# Altium schematic sheet Slave_Supply.SchDoc
size A4
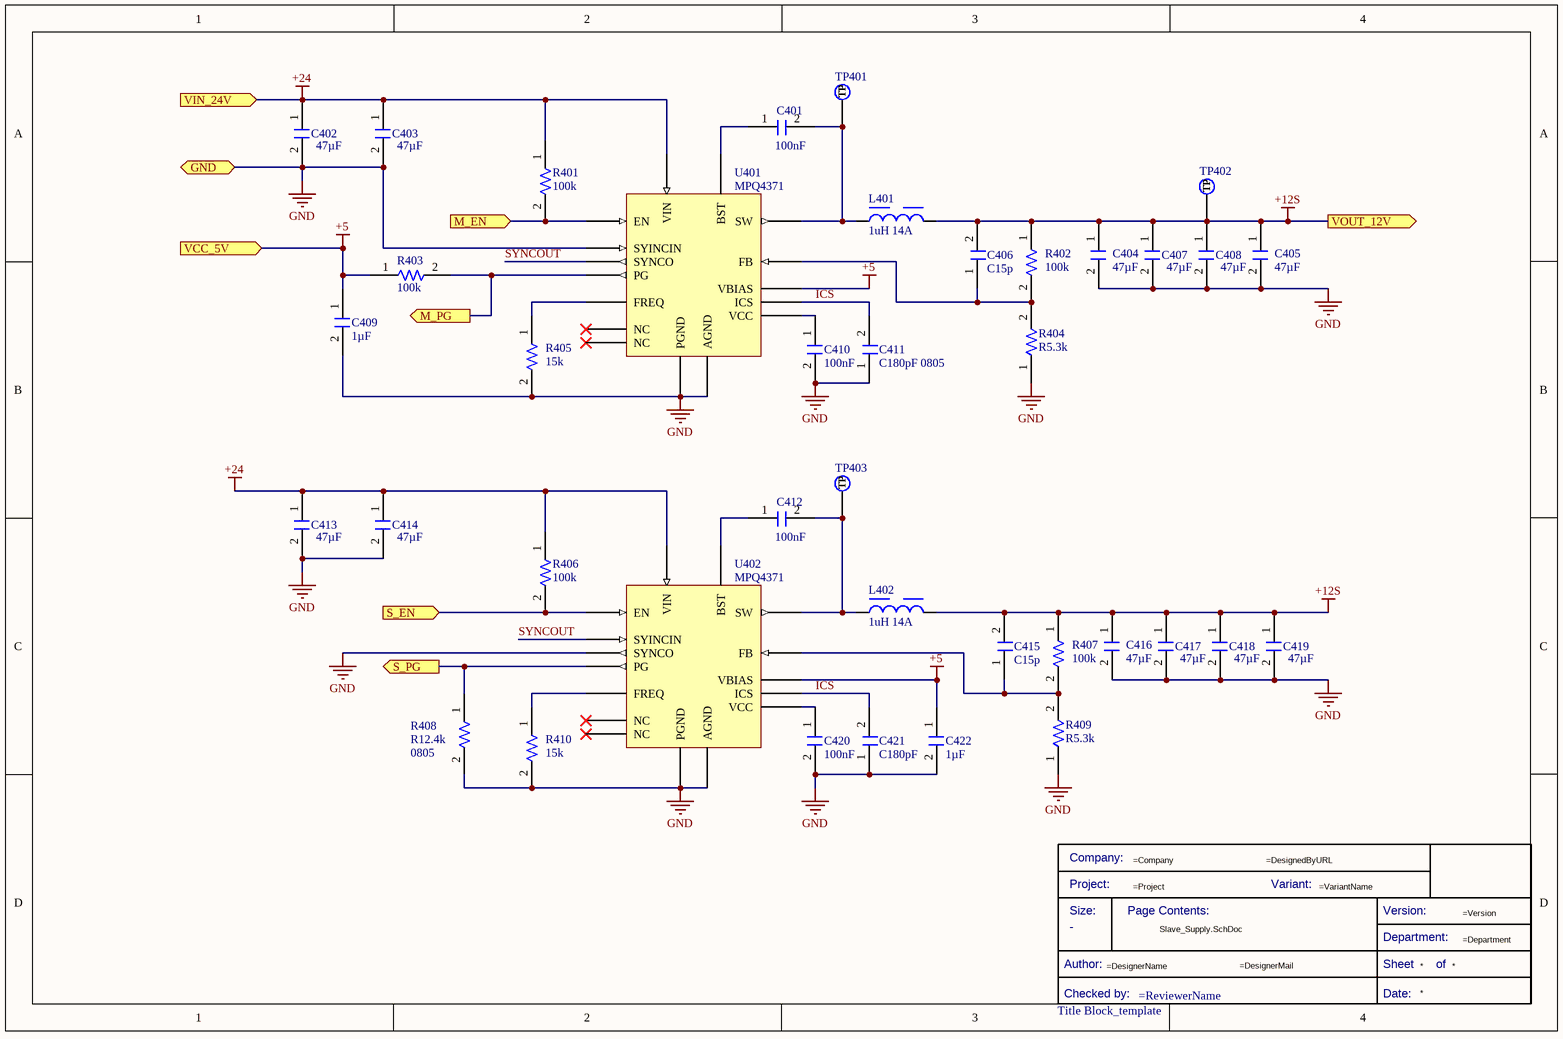
[diagram p0: Slave_Supply.SchDoc]

## Parts
*?  Title Block_template  (graphical)
C401  value 100nF  [C0805FNPC-R]  (hidden comment: C100n-50V-0805FNPC-X7R)
C402  value 47µF  [FP-GRM32E-0_3-0_2-IPC_C]  (hidden comment: GRM32EC81A476KE19L)
C403  value 47µF  [FP-GRM32E-0_3-0_2-IPC_C]  (hidden comment: GRM32EC81A476KE19L)
C404  value 47µF  [FP-GRM32E-0_3-0_2-IPC_C]  (hidden comment: GRM32EC81A476KE19L)
C405  value 47µF  [FP-GRM32E-0_3-0_2-IPC_C]  (hidden comment: GRM32EC81A476KE19L)
C406  C15p  [C0805FNPC-R]
C407  value 47µF  [FP-GRM32E-0_3-0_2-IPC_C]  (hidden comment: GRM32EC81A476KE19L)
C408  value 47µF  [FP-GRM32E-0_3-0_2-IPC_C]  (hidden comment: GRM32EC81A476KE19L)
C409  value 1µF  [C0805FNPC-R]  (hidden comment: C1u-50V-0805FNPC-X7R)
C410  value 100nF  [C0805FNPC-R]  (hidden comment: C100n-50V-0805FNPC-X7R)
C411  C180pF 0805  [C0805FNPC-W]
C412  value 100nF  [C0805FNPC-R]  (hidden comment: C100n-50V-0805FNPC-X7R)
C413  value 47µF  [FP-GRM32E-0_3-0_2-IPC_C]  (hidden comment: GRM32EC81A476KE19L)
C414  value 47µF  [FP-GRM32E-0_3-0_2-IPC_C]  (hidden comment: GRM32EC81A476KE19L)
C415  C15p  [C0805FNPC-R]
C416  value 47µF  [FP-GRM32E-0_3-0_2-IPC_C]  (hidden comment: GRM32EC81A476KE19L)
C417  value 47µF  [FP-GRM32E-0_3-0_2-IPC_C]  (hidden comment: GRM32EC81A476KE19L)
C418  value 47µF  [FP-GRM32E-0_3-0_2-IPC_C]  (hidden comment: GRM32EC81A476KE19L)
C419  value 47µF  [FP-GRM32E-0_3-0_2-IPC_C]  (hidden comment: GRM32EC81A476KE19L)
C420  value 100nF  [C0805FNPC-R]  (hidden comment: C100n-50V-0805FNPC-X7R)
C421  C180pF  [C0805FNPC-W]
C422  value 1µF  [C0805FNPC-R]  (hidden comment: C1u-50V-0805FNPC-X7R)
L401  1uH 14A  [WE-HCI_1030]
L402  1uH 14A  [WE-HCI_1030]
R401  value 100k  [RESC2013X70X40NL20T20]  (hidden comment: ERJ-6GEYJ104V)
R402  value 100k  [FP-CR0805-IPC_A]  (hidden comment: R60.4K-0805)
R403  value 100k  [RESC2013X70X40NL20T20]  (hidden comment: ERJ-6GEYJ104V)
R404  R5.3k  [0805]
R405  value 15k  [RESC2013X50X30ML20T20]  (hidden comment: R15K-0805)
R406  value 100k  [RESC2013X70X40NL20T20]  (hidden comment: ERJ-6GEYJ104V)
R407  value 100k  [FP-CR0805-IPC_A]  (hidden comment: R60.4K-0805)
R408  0805  value R12.4k  [0805]
R409  R5.3k  [0805]
R410  value 15k  [RESC2013X50X30ML20T20]  (hidden comment: R15K-0805)
TP401  TestPoint  [TestPoint]  (value not drawn)  (no BOM)
TP402  TestPoint  [TestPoint]  (value not drawn)  (no BOM)
TP403  TestPoint  [TestPoint]  (value not drawn)  (no BOM)
U401  MPQ4371  [MPQ4371-AEQ1]
U402  MPQ4371  [MPQ4371-AEQ1]

## Ports
GND (bidir), M_EN (in), M_PG (out), S_EN (in), S_PG (out), VCC_5V (in), VIN_24V (in), VOUT_12V (out)

## Nets
+5: C409.1 C422.1 R403.1 U401.11(VBIAS) U402.11(VBIAS) ; port VCC_5V
+12S: C404.1 C405.1 C406.2 C407.1 C408.1 C415.2 C416.1 C417.1 C418.1 C419.1 L401.2 L402.2 R402.1 R407.1 TP402.1(TP) ; port VOUT_12V
+24: C402.1 C403.1 C413.1 C414.1 R401.1 R406.1 U401.15(VIN) U402.15(VIN) ; port VIN_24V
GND: C402.2 C403.2 C404.2 C405.2 C407.2 C408.2 C409.2 C410.2 C411.1 C413.2 C414.2 C416.2 C417.2 C418.2 C419.2 C420.2 C421.1 C422.2 R404.1 R405.2 R408.2 R409.1 R410.2 U401.2(SYINCIN) U401.7(PGND) U401.8(AGND) U402.3(SYNCO) U402.7(PGND) U402.8(AGND) ; port GND
ICS: C411.2 C421.2 U401.10(ICS) U402.10(ICS)
M_EN: R401.2 U401.1(EN) ; port M_EN
M_PG: R403.2 U401.4(PG) ; port M_PG
S_EN: R406.2 U402.1(EN) ; port S_EN
S_PG: R408.1 U402.4(PG) ; port S_PG
SYNCOUT: U401.3(SYNCO) U402.2(SYINCIN)
NetC401_1: C401.1 U401.14(BST)
NetC401_2: C401.2 L401.1 TP401.1(TP) U401.13(SW)
NetC406_1: C406.1 R402.2 R404.2 U401.12(FB)
NetC410_1: C410.1 U401.9(VCC)
NetC412_1: C412.1 U402.14(BST)
NetC412_2: C412.2 L402.1 TP403.1(TP) U402.13(SW)
NetC415_1: C415.1 R407.2 R409.2 U402.12(FB)
NetC420_1: C420.1 U402.9(VCC)
NetR405_1: R405.1 U401.5(FREQ)
NetR410_1: R410.1 U402.5(FREQ)

Not connected (* = marked no-connect by the designer): U401 6(NC)* 16(NC)*; U402 6(NC)* 16(NC)*

## Notes on the sheet
- (in symbol CMP-00043-2) Company:; Project:; Variant:; Size:; Page Contents:; Version:; Department:; Author:; Sheet; of; Checked by:; Date:

## Library data of the parts
*? = CMP-00043-2: Standard Title Block; .Creator: GP; Checked by:: =ReviewerName; Size: -; Design Item ID: Title Block_template; Category: Title Block; .PCBcheck: GP; Source: e-Tech_Racing.SchLib; .SCHcheck: GP
C401 C410 C412 C420 = CMP-00063-1: Cap, 0.1ΜF, 50V, 10%, X7R, 0805; Manufacturer 1: Wurth Electronics; Manufacturer Part Number 1: 885012207098; .Creator: DR; Pricing 1: 100=0,10200, 500=0,07100, 2000=0,06100 (GBP); ComponentLink1URL: http://www.farnell.com/datasheets/1958498.pdf?src-supplier=Farnell; Design Item ID: C100n-50V-0805FNPC-X7R; Voltage Rating (DC): 50V; Voltage Rating: 50V; Max Operating Temperature: 125°C; RoHS: Yes; Case Code (Metric): 2012; Mount: Surface Mount; REACH SVHC: Unknown; Stock 1: 8000; Source: Passives.SchLib; Tolerance: 10%; RoHS Compliant: Yes; Dielectric: X7R; ComponentLink2Description: http://www.farnell.com/datasheets/1958498.pdf?src-supplier=Element14; ComponentLink2URL: http://www.farnell.com/datasheets/1958498.pdf?src-supplier=Element14; Min Operating Temperature: -55°C; Width: 0.049inch; Category: Ceramic Capacitors; Thickness: 0.035inch; Length: 0.079inch; ComponentLink3URL: https://katalog.we-online.de/pbs/datasheet/885012207098.pdf?src-supplier=Digi-Key; Case/Package: 0805; ComponentLink3Description: https://katalog.we-online.de/pbs/datasheet/885012207098.pdf?src-supplier=Digi-Key; Packaging: Cut Tape; ComponentLink1Description: http://www.farnell.com/datasheets/1958498.pdf?src-supplier=Farnell; ComponentLink4Description: http://www.farnell.com/datasheets/1958498.pdf?src-supplier=Newark; ComponentLink4URL: http://www.farnell.com/datasheets/1958498.pdf?src-supplier=Newark
C402-C405 C407 C408 C413 C414 C416-C419 = CMP-001-00003-1: Ceramic Capacitor, Multilayer, Ceramic, 10V, 10% +Tol, 10% -Tol, X6S, 22% TC, 47uF, Surface Mount, 1210; RoHS Compliant: Yes; Pins: 2; Min Operating Temperature: -55°C; Mounting Technology: Surface Mount; Capacitor Type: Ceramic; Max Operating Temperature: 105°C; Case/Package: 1210
C406 C415 = CMP-00056-3: Cap, 15PF, 50V, 5%, C0G/NP0, 0805; Manufacturer Part Number 1: 885012007052; Manufacturer 1: Wurth Electronics; .Creator: DR; Thickness: 0.028inch; RoHS Compliant: Yes; ComponentLink2URL: http://katalog.we-online.de/pbs/datasheet/885012007052.pdf?src-supplier=Digi-Key; Design Item ID: C15p-50V-0805FNPC-NP0; Case Code (Metric): 2012; Max Operating Temperature: 125°C; Mount: Surface Mount; Category: Ceramic Capacitors; Min Operating Temperature: -55°C; Case/Package: 0805; ComponentLink3Description: https://katalog.we-online.de/pbs/datasheet/885012007052.pdf?src-supplier=Digi-Key; ComponentLink1Description: http://www.farnell.com/datasheets/2031702.pdf?src-supplier=Farnell; ComponentLink1URL: http://www.farnell.com/datasheets/2031702.pdf?src-supplier=Farnell; RoHS: Yes; Voltage Rating: 50V; Length: 0.079inch; Source: Passives.SchLib; Value: 15pF; Pricing 1: 1=0,10800, 10=0,05200, 25=0,05100, 50=0,04900, 100=0,04800, 250=0,04600, 500=0,04300 (USD); Tolerance: 5%; ComponentLink3URL: https://katalog.we-online.de/pbs/datasheet/885012007052.pdf?src-supplier=Digi-Key; Stock 1: 815; Packaging: Cut Tape; Width: 0.049inch; ComponentLink2Description: http://katalog.we-online.de/pbs/datasheet/885012007052.pdf?src-supplier=Digi-Key
C409 C422 = CMP-00052-1: Multilayer Ceramic Capacitor, Wcap-Csgp Series, 1 F, 10%, X7R, 50 V, 0805 [2012 Metric] Rohs Compliant: Yes; Manufacturer Part Number 1: 885012207103; Manufacturer 1: Wurth Electronics; Voltage Rating (DC): 50V; .Creator: GP; Max Operating Temperature: 85°C; Case/Package: 0805; ComponentLink1Description: http://www.farnell.com/datasheets/1958501.pdf?src-supplier=Farnell; Design Item ID: C1u-50V-0805FNPC-X7R; ComponentLink1URL: http://www.farnell.com/datasheets/1958501.pdf?src-supplier=Farnell; ComponentLink2Description: http://www.farnell.com/datasheets/1958501.pdf?src-supplier=Element14; ComponentLink3URL: https://katalog.we-online.de/pbs/datasheet/885012107003.pdf?src-supplier=Digi-Key; ComponentLink4Description: http://www.farnell.com/datasheets/1958501.pdf?src-supplier=Newark; Width: 0.049inch; RoHS Compliant: Yes; Case Code (Metric): 2012; Source: Passives.SchLib; Category: Ceramic Capacitors; Tolerance: 10%; Pricing 1: 50=0,27200, 250=0,25300, 500=0,22800, 1250=0,20100, 2500=0,17100 (GBP); RoHS: Yes; Mount: Surface Mount; Min Operating Temperature: -55°C; ComponentLink4URL: http://www.farnell.com/datasheets/1958501.pdf?src-supplier=Newark; Dielectric: X7R; ComponentLink3Description: https://katalog.we-online.de/pbs/datasheet/885012107003.pdf?src-supplier=Digi-Key; ComponentLink2URL: http://www.farnell.com/datasheets/1958501.pdf?src-supplier=Element14; REACH SVHC: Unknown; Length: 0.079inch; Packaging: Cut Tape; Thickness: 0.053inch; Stock 1: 5100; Voltage Rating: 50V
C411 C421 = CMP-00068-3: Multilayer Ceramic Capacitor, Wcap-Csgp Series, 100 Pf, 5%, C0G / Np0, 50 V, 0805 [2012 Metric] Rohs Compliant: Yes; Manufacturer: Wurth Electronics; Manufacturer Part Number: 885012007057; Voltage Rating: 50V; .Creator: DR; Value: 100pF; Source: Passives.SchLib; ComponentLink2URL: https://katalog.we-online.de/pbs/datasheet/885012007057.pdf?src-supplier=Digi-Key; Tolerance: 5%; ComponentLink3Description: http://www.farnell.com/datasheets/1958443.pdf?src-supplier=Element14; ComponentLink5Description: Where buy it; ComponentLink2Description: https://katalog.we-online.de/pbs/datasheet/885012007057.pdf?src-supplier=Digi-Key; Length: 0.079inch; Voltage Rating (DC): 50V; ComponentLink4Description: http://www.farnell.com/datasheets/1958443.pdf?src-supplier=Newark; Packaging: Cut Tape; Stock 1: 1; Thickness: 0.035inch; ComponentLink4URL: http://www.farnell.com/datasheets/1958443.pdf?src-supplier=Newark; RoHS Compliant: Yes; ComponentLink1URL: http://www.farnell.com/datasheets/1958443.pdf?src-supplier=Farnell; Case/Package: 0805; REACH SVHC: Unknown; RoHS: Yes; Mount: Surface Mount; Design Item ID: C100p-50V-0805FNPC-C0G/NP0; ComponentLink1Description: http://www.farnell.com/datasheets/1958443.pdf?src-supplier=Farnell; Dielectric: C0G; Min Operating Temperature: -55°C; ComponentLink3URL: http://www.farnell.com/datasheets/1958443.pdf?src-supplier=Element14; Case Code (Metric): 2012; Pricing 1: 4000=0,03900, 12000=0,03800 (USD); Max Operating Temperature: 125°C; Width: 0.049inch; ComponentLink5URL: https://www.we-online.com/catalog/en/WCAP-CSGP-50VDC#885012007057; Category: Ceramic Capacitors
L401 L402 = CMP-006-00000-2: General Purpose Inductor, 1uH, 20%, 4242; Self Resonant Frequency: 69MHz; Max Operating Temperature: 150°C; Min Operating Temperature: -40°C; Max Current Rating: 14A; RoHS Compliant: Yes; Tolerance: 20%
R401 R403 R406 = CMP-009-00003-1: Fixed Resistor, Metal Glaze/thick Film, 0.125W, 100000ohm, 150V, 5% +/-Tol, 200ppm/Cel, Surface Mount, 0805; Power: 125mW; Mounting Technology: Surface Mount; Pins: 2; RoHS Compliant: Yes; Case/Package: 0805; Max Operating Temperature: 155°C; Tolerance: 5%; Min Operating Temperature: -55°C
R402 R407 = CMP-009-00001-1: Fixed Resistor, Metal Glaze/thick Film, 0.125W, 60400ohm, 150V, 1% +/-Tol, 100ppm/Cel, Surface Mount, 0805; Power: 125mW; RoHS Compliant: Yes; Mounting Technology: Surface Mount; Tolerance: 1%; Max Operating Temperature: 155°C; Case/Package: 0805; Min Operating Temperature: -55°C; Pins: 2
R404 R409 = CMP-009-00051-1: Thick Film Resistors - SMD 1/8watt 5.3Kohms 1% Non Standard; Power: 125mW; Value: 5.3k; Max Operating Temperature: 155°C; RoHS Compliant: Yes; ComponentLink1Description: Datasheet; ComponentLink1URL: https://www.vishay.com/docs/20008/dcrcw.pdf; Min Operating Temperature: -55°C; Tolerance: 1%; Pins: 2; Mounting Technology: Surface Mount; Case/Package: 0805
R405 R410 = CMP-009-00005-1: Fixed Resistor, Metal Glaze/thick Film, 0.125W, 15000ohm, 150V, 1% +/-Tol, 100ppm/Cel, Surface Mount, 0805; Power: 125mW; Min Operating Temperature: -55°C; Mounting Technology: Surface Mount; RoHS Compliant: No; Tolerance: 1%; Pins: 2; Max Operating Temperature: 155°C; Case/Package: 0805
R408 = CMP-009-00046-1: Fixed Resistor, Metal Glaze/thick Film, 0.125W, 12400ohm, 150V, 1% +/-Tol, 100ppm/Cel, Surface Mount, 0805; Power: 125mW; Pins: 2; Max Operating Temperature: 155°C; Case/Package: 0805; Tolerance: 1%; Min Operating Temperature: -55°C; Mounting Technology: Surface Mount; RoHS Compliant: Yes
TP401-TP403 = CMP-00042-1: Test Point 1x1 mm; .SCHcheck: GP; Category: TestPoint; Source: e-Tech_Racing.SchLib; .Creator: GP; .PCBcheck: GP; Design Item ID: TestPoint
U401 U402 = CMP-00193-6: MPQ4371GVE-1000-AEC1-Z High Voltage DCDC 10 A; pin to pad: 1>3 3>12 4>1 5>18 6>5 7>6+8 8>16 9>15 10>13 11>14 12>17 13>7 14>11 15>4+10 16>9